# EAGLE design schematic (EAGLE 9.5.2)
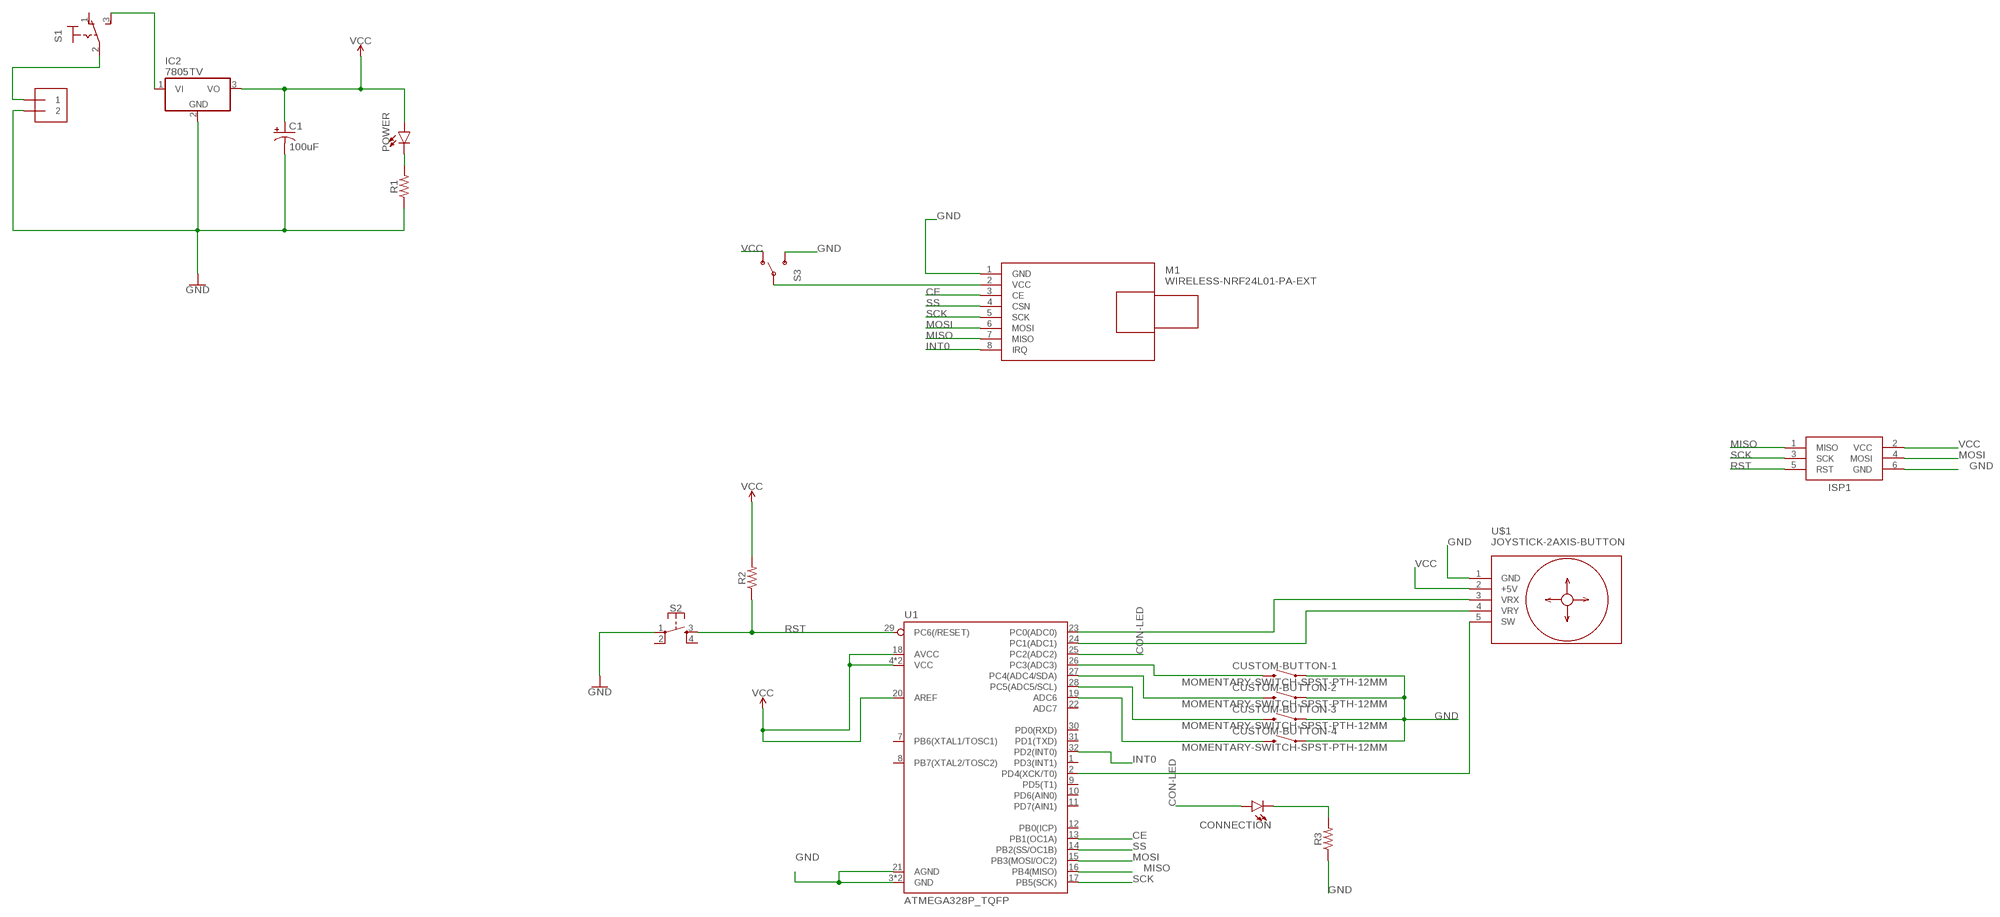
[diagram p0: schematic, sheet 1]

## Parts
C1  100uF  100UF-POLAR-RADIAL-2.5MM-25V-20%  [CPOL-RADIAL-2.5MM-6.5MM]
CONNECTION  LED3MM  [LED_3MM]
CUSTOM-BUTTON-1  MOMENTARY-SWITCH-SPST-PTH-12MM  [TACTILE_SWITCH_PTH_12MM]
CUSTOM-BUTTON-2  MOMENTARY-SWITCH-SPST-PTH-12MM  [TACTILE_SWITCH_PTH_12MM]
CUSTOM-BUTTON-3  MOMENTARY-SWITCH-SPST-PTH-12MM  [TACTILE_SWITCH_PTH_12MM]
CUSTOM-BUTTON-4  MOMENTARY-SWITCH-SPST-PTH-12MM  [TACTILE_SWITCH_PTH_12MM]
IC2  7805TV  [TO220V]
ISP1  AVRISP-6  [AVRISP]
J1  1X2-3.5MM  [1X2-3.5MM]
M1  WIRELESS-NRF24L01-PA-EXT  [WIRELESS-NRF24L01-PA-EXT]
POWER  LED3MM  [LED_3MM]
R1  RESISTOR1206  [1206]
R2  RESISTOR1206  [1206]
R3  RESISTOR1206  [1206]
S1  320-916  [320-916]
S2  MOMENTARY-SWITCH-SPST-2-SMD-4.6X2.8MM  [TACTILE_SWITCH_SMD_4.6X2.8MM]
S3  SWITCH-SPDTSMD  [SWITCH_SPDT_SMD]
U1  ATMEGA328P_TQFP  [TQFP32-08]
U$1  JOYSTICK-2AXIS-BUTTON  [JOYSTICK-2AXIS-BUTTON]

## Nets
CE: M1.3(CE) U1.13(PB1(OC1A))
CON-LED: CONNECTION.A U1.25(PC2(ADC2))
GND: C1.2(-) CUSTOM-BUTTON-1.1 CUSTOM-BUTTON-2.1 CUSTOM-BUTTON-3.1 CUSTOM-BUTTON-4.1 IC2.2(GND) ISP1.6(GND) J1.2 M1.1(GND) R1.1 R3.1 S2.1 S3.3(S) U1.3(GND) U1.5(GND) U1.21(AGND) U$1.1(GND)
INT0: M1.8(IRQ) U1.32(PD2(INT0))
MISO: ISP1.1(MISO) M1.7(MISO) U1.16(PB4(MISO))
MOSI: ISP1.4(MOSI) M1.6(MOSI) U1.15(PB3(MOSI/OC2))
N$1: J1.1 S1.2(P)
N$2: IC2.1(VI) S1.3(S)
N$3: POWER.K(C) R1.2
N$4: M1.2(VCC) S3.2(P)
N$5: CUSTOM-BUTTON-1.3 U1.26(PC3(ADC3))
N$6: CUSTOM-BUTTON-2.3 U1.27(PC4(ADC4/SDA))
N$7: U1.23(PC0(ADC0)) U$1.3(VRX)
N$8: U1.24(PC1(ADC1)) U$1.4(VRY)
N$9: U1.2(PD4(XCK/T0)) U$1.5(SW)
N$10: CUSTOM-BUTTON-3.3 U1.28(PC5(ADC5/SCL))
N$11: CUSTOM-BUTTON-4.3 U1.19(ADC6)
N$13: CONNECTION.K(C) R3.2
RST: ISP1.5(RST) R2.1 S2.3 U1.29(PC6(/RESET))
SCK: ISP1.3(SCK) M1.5(SCK) U1.17(PB5(SCK))
SS: M1.4(CSN) U1.14(PB2(SS/OC1B))
VCC: C1.1(+) IC2.3(VO) ISP1.2(VCC) POWER.A R2.2 S3.1(O) U1.4(VCC) U1.6(VCC) U1.18(AVCC) U1.20(AREF) U$1.2(+5V)
Unconnected: S1.1(O) S2.2 S2.4 U1.1(PD3(INT1)) U1.7(PB6(XTAL1/TOSC1)) U1.8(PB7(XTAL2/TOSC2)) U1.9(PD5(T1)) U1.10(PD6(AIN0)) U1.11(PD7(AIN1)) U1.12(PB0(ICP)) U1.22(ADC7) U1.30(PD0(RXD)) U1.31(PD1(TXD))

## Library data of the parts
C1 = SparkFun-Capacitors:100UF-POLAR: 100µF polarized capacitors A capacitor is a passive two-terminal electrical component used to store electrical energy temporarily in an electric field.; PROD_ID: CAP-08439
CONNECTION POWER = SparkFun-LED:LED: LED (Generic) Standard schematic elements and footprints for 5mm, 3mm, 1206, and 0603 sized LEDs. Generic LEDs with no color specified.; PROD_ID: DIO-08794
CUSTOM-BUTTON-1-CUSTOM-BUTTON-4 = SparkFun-Switches:MOMENTARY-SWITCH-SPST: Momentary Switch (Pushbutton) - SPST Normally-open (NO) SPST momentary switches (buttons, pushbuttons). Variants PTH-12MM - 12mm square, through-hole Momentary Pushbutton Switch - 12mm Square <https://www.sparkfun.com/products/9190> (COM-09190) PTH-6.0MM, PTH-6.0MM-KIT - 6.0mm square, through-hole Mini Pushbutton Switch <https://www.sparkfun.com/products/97> (COM-00097) KIT package intended for soldering kit's - only one side of pads' copper is exposed. PTH-RIGHT-ANGLE-KIT - Right-angle, through-hole Right Angle Tactile Button <https://www.sparkfun.com/products/10791> - Used on SparkFun BigTime Watch Kit <https://www.sparkfun.com/products/11734> SMD-12MM - 12mm square, surface-mount Tactile Button - SMD (12mm) <https://www.sparkfun.com/products/12993> (COM-12993) Used on SparkFun PicoBoard <https://www.sparkfun.com/products/11888> SMD-4.5MM - 4.5mm Square Trackball Switch Used on SparkFun Blackberry Trackballer Breakout <https://www.sparkfun.com/products/13169> SMD-4.6MMX2.8MM - 4.60mm x 2.80mm, surface mount Used on SparkFun SAMD21 Mini Breakout <https://www.sparkfun.com/products/13664> SMD-5.2MM, SMD-5.2-REDUNDANT - 5.2mm square, surface-mount Mini Pushbutton Switch - SMD <https://www.sparkfun.com/products/8720> (COM-08720) Used on Arduino Pro Mini <https://www.sparkfun.com/products/11114> REDUNDANT package connects both switch circuits together SMD-6.0X3.5MM - 6.0 x 3.5mm, surface mount Momentary Reset Switch SMD <https://www.sparkfun.com/products/8229> (COM-08229) SMD-6.2MM-TALL - 6.2mm square, surface mount Tactile Button - SMD (6mm) <https://www.sparkfun.com/products/12992> Used on SparkFun Digital Sandbox <https://www.sparkfun.com/products/12651> SMD-RIGHT-ANGLE - Right-angle, surface mount Used on SparkFun Block for Intel® Edison - Arduino <https://www.sparkfun.com/products/13036>; PROD_ID: SWCH-09185; SF_SKU: COM-09190
IC2 = linear:78*: Positive VOLTAGE REGULATOR Source: http://cache.national.com/ds/LM/LM78L05.pdf http://www.fairchildsemi.com/ds/LM/LM7805.pdf
ISP1 = adafruit:AVRISP: AVR ISP HEADER Standard 6 pin header for AVR programming
J1 = adafruit:1X2: 3.5mm Terminal block http://www.ladyada.net/library/pcb/eaglelibrary.html; SPICEPREFIX: B
M1 = diy-modules:WIRELESS-NRF24L01-PA-EXT: 2.4 GHz Wireless Module based on NRF24L01 chip with preamplifier and external antenna Click here to find device on ebay.com <http://www.ebay.com/sch/nrf24l01+pa+lna+sma>
R1-R3 = SparkFun-Resistors:RESISTOR: Generic Resistor Package
S1 = switch:320-916: TOGGLE SWITCH distributor RS Components
S2 = SparkFun-Switches:MOMENTARY-SWITCH-SPST-2: Momentary Switch (Pushbutton) - SPST - Two Circuits Normally-open (NO) SPST momentary switches (buttons, pushbuttons). Schematic symbol includes two switch circuits. Variants SMD-4.6MMX2.8MM - 4.60mm x 2.80mm Tactile Momentary Button Switch - Used on SparkFun SAMD21 Mini Breakout <https://www.sparkfun.com/products/13664> SMD-5.2MM - Mini Pushbutton Switch - SMD <https://www.sparkfun.com/products/8720> - Used on Arduino Pro Mini <https://www.sparkfun.com/products/11114>; PROD_ID: SWCH-13065
S3 = SparkFun-Retired:SWITCH-SPDT: SPDT Switch Simple slide switch, Spark Fun Electronics SKU : COM-00102 DPDT SMT slide switch, AYZ0202, SWCH-08179
U1 = SparkFun-IC-Microcontroller:ATMEGA328P_TQFP: Popular 328P in QFP Storefront component: ATmega328 - TQFP <https://www.sparkfun.com/products/13448> (COM-13448) Datasheet <http://www.sparkfun.com/datasheets/Components/SMD/ATMega328.pdf> SparkFun Products SparkFun RedBoard - Programmed with Arduino <https://www.sparkfun.com/products/12757> (DEV-12757) Arduino Pro Mini 328 - 5V/16MHz <https://www.sparkfun.com/products/11113> (DEV-11113) Arduino Pro Mini 328 - 3.3V/8MHz <https://www.sparkfun.com/products/11114> (DEV-11114) SparkFun OpenLog <https://www.sparkfun.com/products/13712> (DEV-13712) SparkFun MicroView - OLED Arduino Module <https://www.sparkfun.com/products/12923> (DEV-12923) SparkFun Digital Sandbox <https://www.sparkfun.com/products/12651> (DEV-12651) SparkFun PicoBoard <https://www.sparkfun.com/products/11888> (WIG-11888) Arduino Fio <https://www.sparkfun.com/products/10116> (DEV-10116) LilyPad Arduino 328 Main Board <https://www.sparkfun.com/products/13342> (DEV-13342) SparkFun RedStick <https://www.sparkfun.com/products/13741> (DEV-13741) LilyPad MP3 <https://www.sparkfun.com/products/11013> (DEV-11013) LilyPad Arduino SimpleSnap <https://www.sparkfun.com/products/10941> (DEV-10941) SparkFun Stepoko <https://www.sparkfun.com/products/13899> (ROB-13899) SparkFun Geiger Counter <https://www.sparkfun.com/products/11345> (SEN-11345) SparkFun EL Sequencer <https://www.sparkfun.com/products/12781> (COM-12781) Arduino Pro 328 - 5V/16MHz <https://www.sparkfun.com/products/10915> (DEV-10915) CryptoCape <https://www.sparkfun.com/products/12773> (DEV-12773) SparkFun IR Thermometer Evaluation Board - MLX90614 <https://www.sparkfun.com/products/10740> (SEN-10740) SparkFun RedBot Mainboard <https://www.sparkfun.com/products/12097> (ROB-12097) Arduino Pro 328 - 3.3V/8MHz <https://www.sparkfun.com/products/10914> (DEV-10914) SparkFun Block for Intel® Edison - Arduino <https://www.sparkfun.com/products/13036> (DEV-13036) SparkFun Simon Says - Surface Mount Soldering Kit <https://www.sparkfun.com/products/10935> (KIT-10935) SparkFun 7-Segment Serial Display - Red <https://www.sparkfun.com/products/11441> (COM-11441) SparkFun 7-Segment Serial Display - White <https://www.sparkfun.com/products/11629> (COM-11629) SparkFun 7-Segment Serial Display - Yellow <https://www.sparkfun.com/products/11443> (COM-11443) SparkFun 7-Segment Serial Display - Kelly Green <https://www.sparkfun.com/products/11440> (COM-11440) SparkFun 7-Segment Serial Display - Blue <https://www.sparkfun.com/products/11442> (COM-11442) SparkFun OpenSegment Serial Display - 20mm (Blue) <https://www.sparkfun.com/products/11647> (COM-11647) SparkFun OpenSegment Serial Display - 20mm (Green) <https://www.sparkfun.com/products/11646> (COM-11646) SparkFun OpenSegment Serial Display - 20mm (White) <https://www.sparkfun.com/products/11648> (COM-11648) SparkFun OpenSegment Serial Display - 20mm (Red) <https://www.sparkfun.com/products/11644> (COM-11644) SparkFun OpenSegment Serial Display - 20mm (Yellow) <https://www.sparkfun.com/products/11645> (COM-11645) SparkFun OpenSegment Shield <https://www.sparkfun.com/products/13190> (DEV-13190); PROD_ID: IC-09069
U$1 = diy-modules:JOYSTICK-2AXIS-BUTTON: 2-Axis Analog Joystick with Push Button Tutorial is available here: http://henrysbench.capnfatz.com/henrys-bench/arduino-sensors-and-input/arduino-ps2-joystick-tutorial-keyes-ky-023-deek-robot/ Click here to find device on ebay.com <http://www.ebay.com/sch/joystick+ps2+module>

## Board
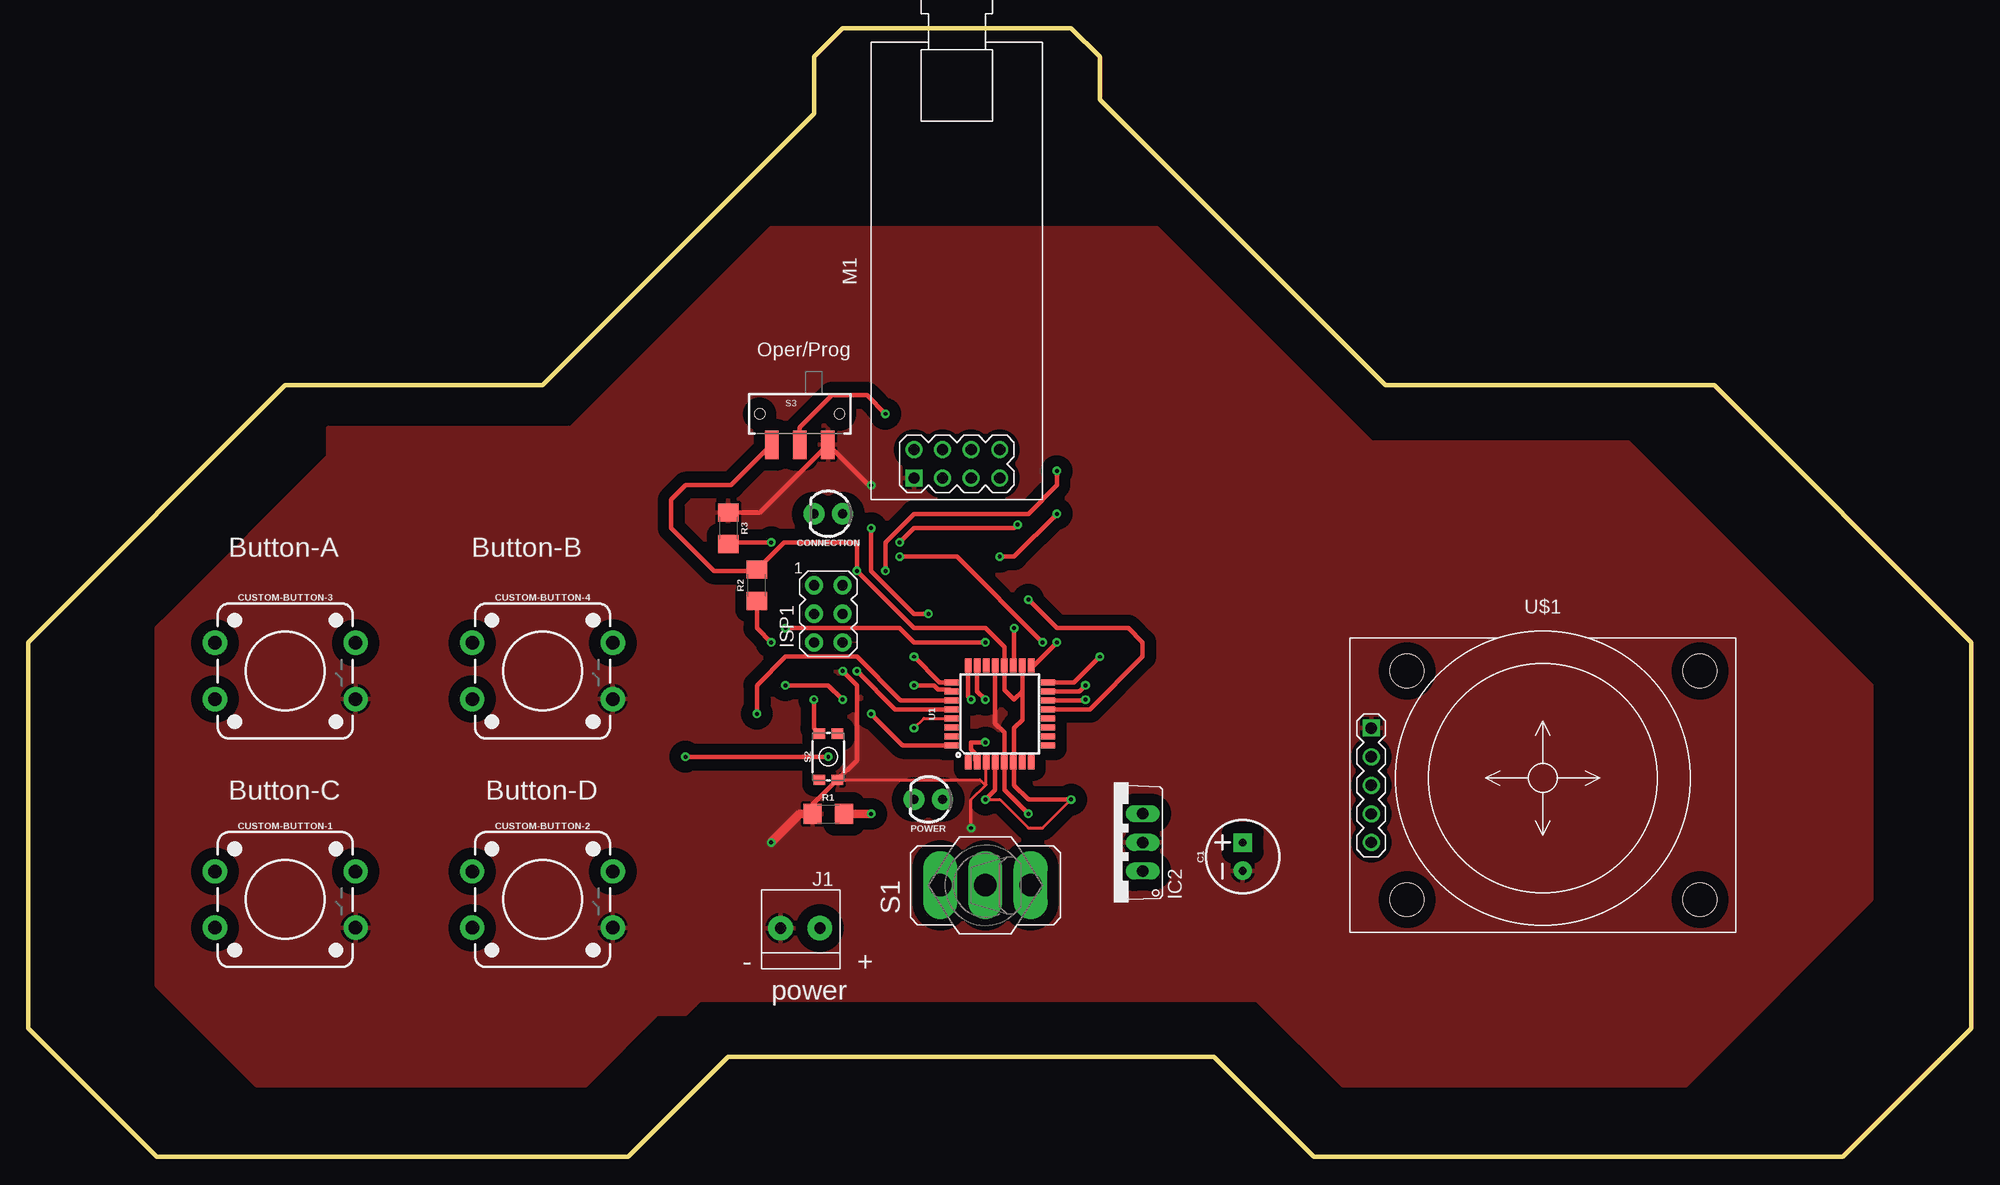
[diagram p1: board, top side]
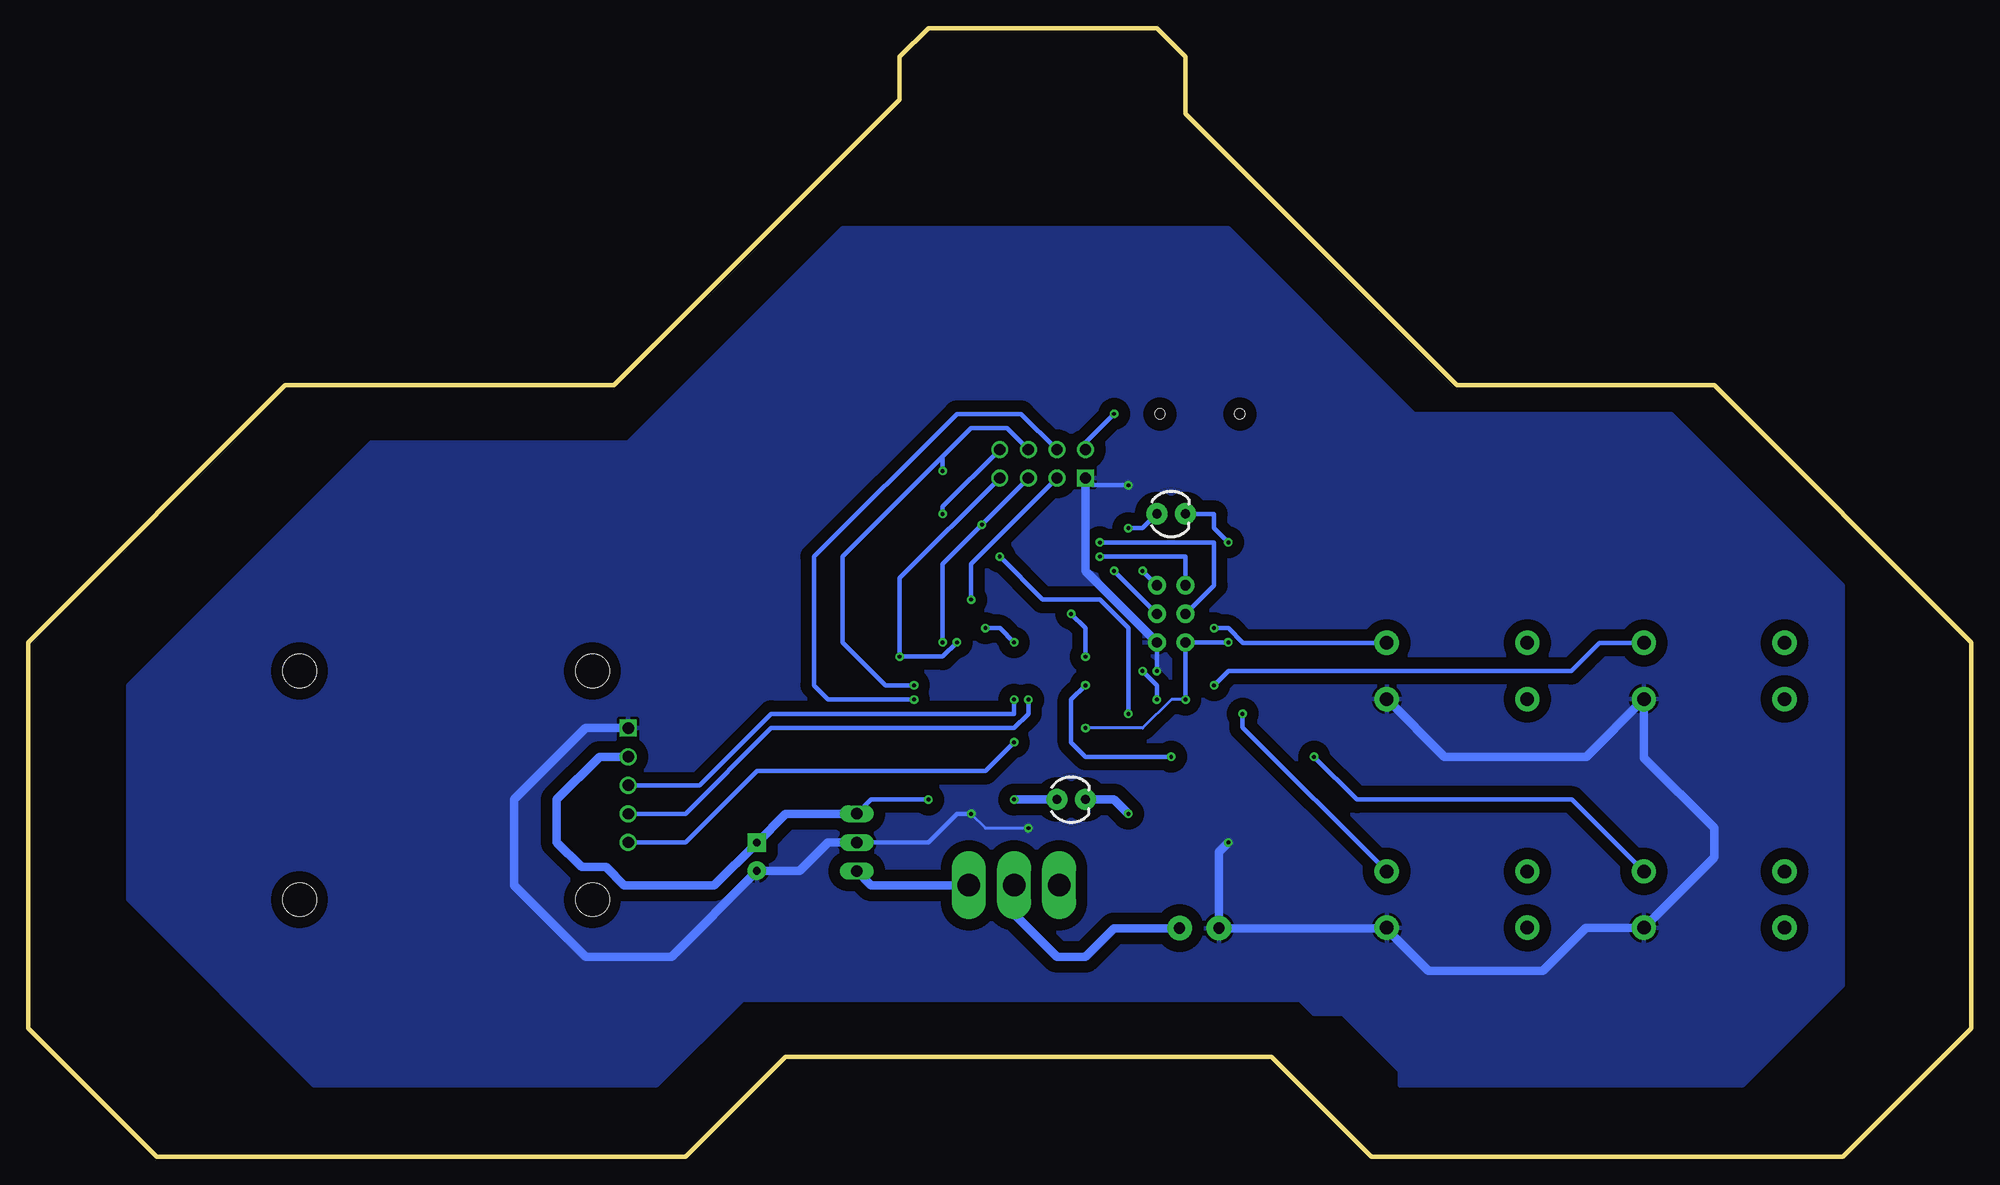
[diagram p2: board, bottom side, seen from below]

Size 172.72 x 100.33 mm. Coordinates in mm from the lower left corner, seen from the top.
Outline: 0,11.43 0,45.72 22.86,68.58 45.72,68.58 69.85,92.71 69.85,97.79 72.39,100.33 92.71,100.33 95.25,97.79 95.25,93.98 120.65,68.58 149.86,68.58 172.72,45.72 172.72,11.43 161.29,0 114.3,0 105.41,8.89 62.23,8.89 53.34,0 11.43,0 0,11.43
Copper layers (1*16): Top 0.035mm / dielectric 1.5mm / Bottom 0.035mm
Design rules "default": minimum track width 6mil, minimum drill 0.35mm, track to track 6mil, track to pad 6mil, pad to pad 6mil, via to via 6mil, smd to smd 6mil, copper to edge 40mil, drill to drill 6mil, minimum pad ring 10mil, minimum via ring 8mil, stop-mask expansion 4mil, vias tented up to drill 0mil, thermal gap 10mil

### Footprints (pad centres in the part's own frame; a part is rotated, then mirrored left to right if it is on the bottom)
CPOL-RADIAL-2.5MM-6.5MM = drill 0.7 pad 1.651 square: 1 1.25,0 | drill 0.7 pad 1.651: 2 -1.25,0
LED_3MM = drill 0.813 pad 1.88: A -1.27,0; K 1.27,0
TACTILE_SWITCH_PTH_12MM = drill 1.2 pad 2.159: 1 6.25,-2.5; 2 -6.25,-2.5; 3 6.25,2.5; 4 -6.25,2.5
TO220V = drill 1.016 long: 1 -2.54,-2.54; 2 0,-2.54; 3 2.54,-2.54
AVRISP = drill 0.9 pad 1.626: 1 -1.27,2.54; 2 1.27,2.54; 3 -1.27,0; 4 1.27,0; 5 -1.27,-2.54; 6 1.27,-2.54
1X2-3.5MM = drill 1 pad 2.184: 1 1.8,0; 2 -1.7,0
WIRELESS-NRF24L01-PA-EXT = drill 1 square: 1 -18.415,3.81 | drill 1: 2 -15.875,3.81; 3 -18.415,1.27; 4 -15.875,1.27; 5 -18.415,-1.27; 6 -15.875,-1.27; 7 -18.415,-3.81; 8 -15.875,-3.81
1206 = smd 1.6 x 1.8: 1 -1.4,0; 2 1.4,0
320-916 = drill 2.007 long: 1 0,4.013; 2 0,0; 3 0,-4.013
TACTILE_SWITCH_SMD_4.6X2.8MM = smd 0.9 x 1: 1 -2.05,-0.8; 2 2.05,-0.8; 3 2.05,0.8; 4 -2.05,0.8
SWITCH_SPDT_SMD = smd 1.2 x 2.5: 1 -2.5,-2.75; 2 0,-2.75; 3 2.5,-2.75 | hole 0.9: -3.55,0; 3.55,0
TQFP32-08 = smd 1.27 x 0.559: 1 -4.293,2.8; 2 -4.293,2; 3 -4.293,1.2; 4 -4.293,0.4; 5 -4.293,-0.4; 6 -4.293,-1.2; 7 -4.293,-2; 8 -4.293,-2.8; 17 4.293,-2.8; 18 4.293,-2; 19 4.293,-1.2; 20 4.293,-0.4; 21 4.293,0.4; 22 4.293,1.2; 23 4.293,2; 24 4.293,2.8 | smd 0.559 x 1.27: 9 -2.8,-4.293; 10 -2,-4.293; 11 -1.2,-4.293; 12 -0.4,-4.293; 13 0.4,-4.293; 14 1.2,-4.293; 15 2,-4.293; 16 2.8,-4.293; 25 2.8,4.293; 26 2,4.293; 27 1.2,4.293; 28 0.4,4.293; 29 -0.4,4.293; 30 -1.2,4.293; 31 -2,4.293; 32 -2.8,4.293
JOYSTICK-2AXIS-BUTTON = drill 1 square: 1 -15.24,5.08 | drill 1: 2 -15.24,2.54; 3 -15.24,0; 4 -15.24,-2.54; 5 -15.24,-5.08 | hole 3: -12.065,10.16; -12.065,-10.16; 13.97,-10.16; 13.97,10.16

### Placement (x,y rotation side)
C1  107.95,26.67 90 top
CONNECTION  71.12,57.15 180 top
CUSTOM-BUTTON-1  22.86,22.86 0 top
CUSTOM-BUTTON-2  45.72,22.86 0 top
CUSTOM-BUTTON-3  22.86,43.18 0 top
CUSTOM-BUTTON-4  45.72,43.18 0 top
IC2  96.52,27.94 90 top
ISP1  71.12,48.26 0 top
J1  68.58,20.32 0 top
M1  82.55,78.74 90 top
POWER  80.01,31.75 180 top
R1  71.12,30.48 0 top
R2  64.77,50.8 90 top
R3  62.23,55.88 270 top
S1  85.09,24.13 90 top
S2  71.12,35.56 90 top
S3  68.58,66.04 0 top
U1  86.36,39.37 90 top
U$1  134.62,33.02 0 top

### Tracks (layer width: path | path; a pad name or v marks a point on that pad's centre or on a via)
CE  (via drill 0.35)
  Top 0.381: v88.9,49.53 91.44,46.99 97.79,46.99 99.06,45.72 99.06,44.45 94.38,39.77 U1.13
  Bottom 0.381: M1.3 88.9,52.7 v88.9,49.53
CON-LED  (via drill 0.35)
  Top 0.381: v74.93,55.88 74.93,52.07 78.74,48.26 v80.01,48.26 | v78.74,44.45 81.02,42.17 U1.25
  Bottom 0.381: CONNECTION.A 73.66,55.88 v74.93,55.88 | v80.01,48.26 78.74,46.99 v78.74,44.45
GND  (via drill 0.35)
  Top 0.254: S2.1 84.6,33.51 85.09,33.02 | 85.09,33.02 85.16,33.09 U1.3 | v83.82,29.21 83.82,31.75 85.09,33.02
  Top 0.381: v88.9,30.48 86.76,32.62 U1.5 86.76,37.7 85.96,38.5 U1.21 | R1.1 69.72,31.31 S2.1 73.66,35.25 73.66,41.91 v72.39,43.18 | R3.1 65.07,57.28 S3.3 74.68,59.69 v74.93,59.69
  Top 0.762: v66.04,27.94 68.58,30.48 R1.1
  Bottom 0.254: v88.9,30.48 87.63,29.21 v83.82,29.21
  Bottom 0.381: v88.9,30.48 90.17,30.48 92.71,27.94 IC2.2 | v72.39,43.18 ISP1.6 | v74.93,59.69 78.1,59.69 M1.1
  Bottom 0.762: 52.01,20.32 J1.2 66.88,27.1 v66.04,27.94 | 52.01,20.32 CUSTOM-BUTTON-2.1 | 52.01,20.32 52.01,20.26 48.26,16.51 38.1,16.51 34.25,20.36 CUSTOM-BUTTON-1.1 22.86,26.61 22.86,29.21 29.11,35.46 CUSTOM-BUTTON-3.1 34.23,35.56 46.85,35.56 CUSTOM-BUTTON-4.1 | C1.2 107.93,25.4 | 107.93,25.4 104.14,25.4 101.6,27.94 IC2.2 | U$1.1 123.19,38.1 129.54,31.75 129.54,24.13 123.19,17.78 115.55,17.78 107.93,25.4 | M1.1 78.74,52.07 ISP1.6
  pour Top (isolate 1.016): 26.67,64.77 48.26,64.77 57.15,73.66 66.04,82.55 93.98,82.55 100.33,82.55 101.6,81.28 119.38,63.5 142.24,63.5 163.83,41.91 163.83,22.86 147.32,6.35 142.24,6.35 116.84,6.35 109.22,13.97 59.69,13.97 58.42,12.7 55.88,12.7 49.53,6.35 20.32,6.35 11.43,15.24 11.43,46.99 12.7,48.26 26.67,62.23
  pour Bottom (isolate 1.016): 26.67,66.04 48.26,66.04 49.53,66.04 66.04,82.55 100.33,82.55 119.38,63.5 142.24,63.5 163.83,41.91 163.83,22.86 147.32,6.35 116.84,6.35 109.22,13.97 60.96,13.97 59.69,13.97 58.42,12.7 55.88,12.7 50.8,7.62 50.8,6.35 20.32,6.35 11.43,15.24 11.43,48.26 11.43,50.8
INT0  (via drill 0.35)
  Top 0.381: v91.44,57.15 87.63,53.34 v86.36,53.34 | U1.32 77.73,36.57 v74.93,39.37
  Bottom 0.381: M1.8 91.44,57.78 v91.44,57.15 | v86.36,53.34 82.55,49.53 77.47,49.53 74.93,46.99 v74.93,39.37
MISO  (via drill 0.35)
  Top 0.381: v95.25,44.45 92.97,42.17 U1.16 | v77.47,53.34 82.55,53.34 v90.17,45.72
  Bottom 0.381: M1.7 95.25,51.44 v95.25,44.45 91.44,44.45 v90.17,45.72 | ISP1.1 69.85,53.34 v77.47,53.34
MOSI  (via drill 0.35)
  Top 0.381: v93.98,41.91 93.44,41.37 U1.15 | v76.2,52.07 76.2,54.61 78.74,57.15 88.9,57.15 91.44,59.69 v91.44,60.96
  Bottom 0.381: M1.6 85.72,64.77 88.9,64.77 91.44,62.23 | 91.44,62.23 100.33,53.34 100.33,45.72 96.52,41.91 v93.98,41.91 | ISP1.4 v76.2,52.07 | v91.44,60.96 91.44,62.23
N$1
  Bottom 0.762: J1.1 76.2,20.32 78.74,17.78 81.28,17.78 85.09,21.59 S1.2
N$2
  Bottom 0.762: S1.3 97.79,24.13 IC2.1
N$3  (via drill 0.35)
  Top 0.762: R1.2 v74.93,30.48
  Bottom 0.762: v74.93,30.48 76.2,31.75 POWER.K
N$4  (via drill 0.35)
  Top 0.381: S3.2 68.58,64.83 71.44,67.7 74.54,67.7 v76.2,66.04
  Bottom 0.381: v76.2,66.04 78.74,63.5 M1.2
N$5  (via drill 0.35)
  Top 0.381: v58.42,35.56 v71.12,35.56 | v78.74,41.91 80.53,41.91 80.89,41.55 81.89,41.55 U1.26
  Bottom 0.381: CUSTOM-BUTTON-1.3 35.5,31.75 54.61,31.75 v58.42,35.56 | v71.12,35.56 78.74,35.56 80.01,36.83 80.01,40.64 v78.74,41.91
N$6  (via drill 0.35)
  Top 0.381: U1.27 77.54,40.57 73.66,44.45 67.31,44.45 64.77,41.91 v64.77,39.37
  Bottom 0.381: v64.77,39.37 64.77,38.16 CUSTOM-BUTTON-2.3
N$7  (via drill 0.35)
  Top 0.381: v85.09,40.64 84.36,41.37 U1.23
  Bottom 0.381: U$1.3 113.03,33.02 106.68,39.37 85.09,39.37 v85.09,40.64
N$8  (via drill 0.35)
  Top 0.381: v83.82,40.64 83.56,40.9 U1.24
  Bottom 0.381: U$1.4 114.3,30.48 106.68,38.1 85.09,38.1 83.82,39.37 v83.82,40.64
N$9  (via drill 0.35)
  Top 0.381: v85.09,36.83 83.82,36.83 83.82,36.22 84.18,35.85 84.18,35.26 U1.2
  Bottom 0.381: U$1.5 114.3,27.94 107.95,34.29 87.63,34.29 v85.09,36.83
N$10  (via drill 0.35)
  Top 0.381: v67.31,41.91 71.12,41.91 v72.39,40.64 | v73.66,43.18 77.07,39.77 U1.28
  Bottom 0.381: CUSTOM-BUTTON-3.3 33.06,45.68 35.56,43.18 66.04,43.18 v67.31,41.91 | v72.39,40.64 72.39,41.91 v73.66,43.18
N$11  (via drill 0.35)
  Top 0.381: v85.09,45.72 78.74,45.72 77.47,46.99 v67.31,46.99 | v87.63,46.99 87.63,43.73 U1.19
  Bottom 0.381: CUSTOM-BUTTON-4.3 64.73,45.68 66.04,46.99 v67.31,46.99 | v85.09,45.72 86.36,46.99 v87.63,46.99
N$13  (via drill 0.35)
  Top 0.381: R3.2 62.36,54.61 v66.04,54.61
  Bottom 0.381: v66.04,54.61 67.31,55.88 67.31,57.15 CONNECTION.K
RST  (via drill 0.35)
  Top 0.254: v78.74,38.1 79.61,38.97 U1.29
  Top 0.381: v69.85,40.64 69.85,38.08 S2.3 | R2.1 64.77,46.99 v66.04,45.72
  Bottom 0.254: v69.85,40.64 71.12,40.64 73.66,38.1 v78.74,38.1
  Bottom 0.381: v69.85,40.64 ISP1.5 v66.04,45.72
SCK  (via drill 0.35)
  Top 0.381: v91.44,45.72 89.38,43.66 U1.17 | v77.47,54.61 78.74,55.88 87.63,55.88 v87.95,56.2
  Bottom 0.381: M1.5 v87.95,56.2 91.44,52.7 v91.44,45.72 | ISP1.3 67.31,50.8 67.31,54.61 v77.47,54.61
SS  (via drill 0.35)
  Top 0.381: v93.98,40.64 93.91,40.57 U1.14
  Bottom 0.381: M1.4 84.45,66.04 90.17,66.04 102.87,53.34 102.87,41.91 101.6,40.64 v93.98,40.64
VCC  (via drill 0.35)
  Top 0.254: v85.09,31.75 86.36,31.75 88.9,29.21 90.17,29.21 v92.71,31.75
  Top 0.381: v85.09,31.75 85.96,32.62 U1.4 | U1.6 87.63,35.01 | 87.63,35.01 87.63,33.02 88.9,31.75 v92.71,31.75 | S3.1 62.48,59.69 58.42,59.69 57.15,58.42 57.15,55.88 60.96,52.07 64.64,52.07 R2.2 67.18,54.61 73.66,54.61 v73.66,52.07 78.74,46.99 85.09,46.99 86.76,45.32 U1.20 86.76,41.51 87.63,40.64 88.36,41.37 U1.18 88.36,38.83 87.63,38.1 87.63,35.01
  Bottom 0.381: v92.71,31.75 97.79,31.75 IC2.3 | ISP1.2 v73.66,52.07
  Bottom 0.762: IC2.3 105.39,30.48 C1.1 111.74,24.13 119.73,24.13 121.35,25.76 123.55,25.76 125.73,27.94 125.73,31.75 121.92,35.56 U$1.2 | POWER.A v85.09,31.75

### Text on the board
tPlace: Oper/Prog | Button-A | Button-B | Button-C | Button-D | - | + | power